# Altium schematic sheet C64IntfcTop.SchDoc
size A
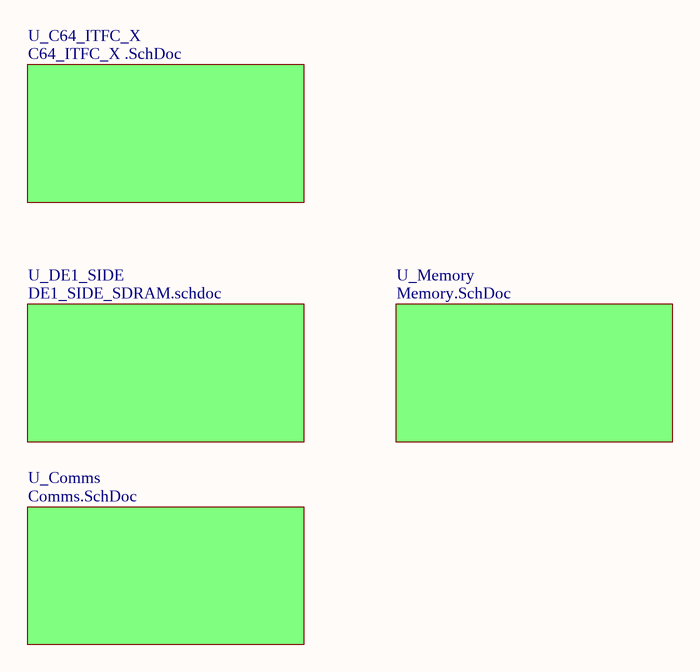
[diagram p0: C64IntfcTop.SchDoc]

## Sub-sheets
U_C64_ITFC_X = C64_ITFC_X .SchDoc: no entries
U_Comms = Comms.SchDoc: no entries
U_DE1_SIDE = DE1_SIDE_SDRAM.schdoc: no entries
U_Memory = Memory.SchDoc: no entries